# Altium project lemonCakes Project.PrjPcb
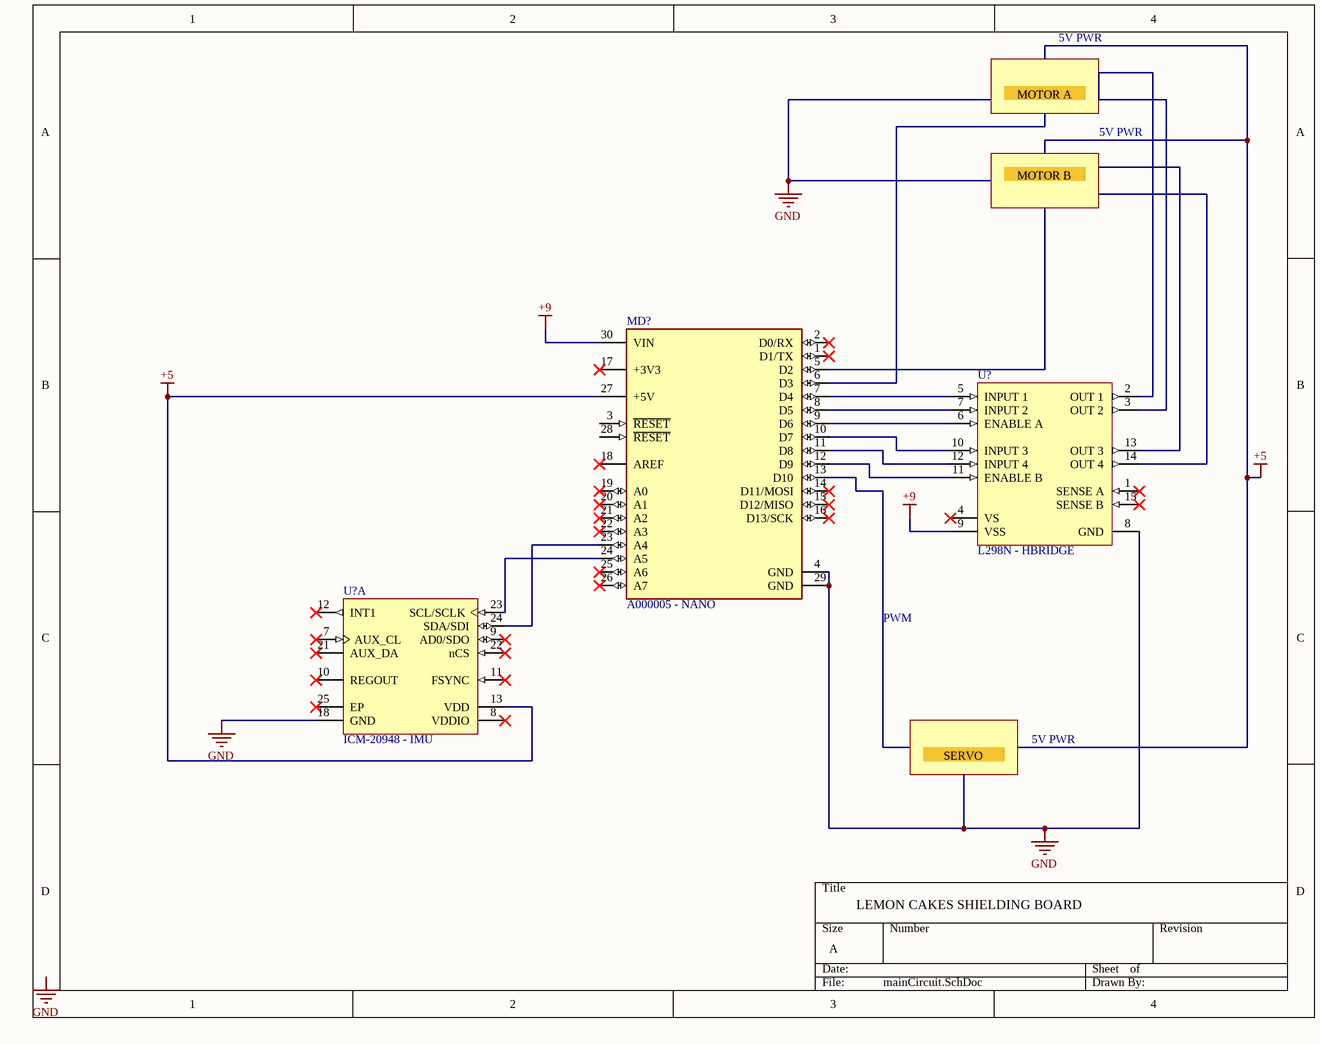
[diagram p0: mainCircuit.SchDoc]
1 sheet, 3 parts. Net scope: global (net labels, ports and power ports of the same name join across sheets).

## Sheet mainCircuit.SchDoc
size A; SheetNumber: 1; SheetTotal: 1

### Parts
(Parts that share a designator on the sheet are numbered #1, #2 ... from top to bottom, then left to right.)
MD?  A000005 - NANO  [FP-A000005-MFG]
U?#1  L298N - HBRIDGE  [STM-FM-15]
U?#2  ICM-20948 - IMU  [TDK-QFN-24_L]  (part A of 2)

### Nets
+5: MD?.27(+5V) U?#2.13(VDD)
+9: MD?.30(VIN) U?#1.9(VSS)
GND: MD?.4(GND) MD?.29(GND) U?#1.8(GND) U?#2.18(GND)
NetMD?_7: MD?.7(D4) U?#1.5(INPUT_1)
NetMD?_8: MD?.8(D5) U?#1.7(INPUT_2)
NetMD?_9: MD?.9(D6) U?#1.6(ENABLE_A)
NetMD?_10: MD?.10(D7) U?#1.10(INPUT_3)
NetMD?_11: MD?.11(D8) U?#1.12(INPUT_4)
NetMD?_12: MD?.12(D9) U?#1.11(ENABLE_B)
NetMD?_23: MD?.23(A4) U?#2.24(SDA/SDI)
NetMD?_24: MD?.24(A5) U?#2.23(SCL/SCLK)
NetU?#1_2: U?#1.2(OUT_1) U?#1.3(OUT_2)

Not connected (* = marked no-connect by the designer): MD? 1(D1/TX)* 2(D0/RX)* 3(~{RESET}) 5(D2) 6(D3) 13(D10) 14(D11/MOSI)* 15(D12/MISO)* 16(D13/SCK)* 17(+3V3)* 18(AREF)* 19(A0)* 20(A1)* 21(A2)* 22(A3)* 25(A6)* 26(A7)* 28(~{RESET}); U?#1 1(SENSE_A)* 4(VS)* 13(OUT_3) 14(OUT_4) 15(SENSE_B)*; U?#2 7(AUX_CL)* 8(VDDIO)* 9(AD0/SDO)* 10(REGOUT)* 11(FSYNC)* 12(INT1)* 21(AUX_DA)* 22(nCS)* 25(EP)*

### Notes on the sheet
- MOTOR A
- 5V PWR
- MOTOR B
- PWM
- SERVO
- LEMON CAKES SHIELDING BOARD
- Labels drawn without touching a wire or pin: GND

### Library data of the parts
MD? = CMP-189986-000002-1: ARDUINO NANO ATMEGA328 EVAL BRD; Number of Bits: 8; Evaluation Kit: Yes; Operating Supply Voltage: 12V; Interface: I2C; Data Bus Width: 8b; Core Architecture: AVR; Packaging: Bulk; Length: 7inch; Package Quantity: 50; Width: 5inch; REACH SVHC: No SVHC; Weight: 0.358383oz; Series: AVR® ATmega; Height: 0.25inch
U?#1 = CMP-2000-06526-1: Dual Full-Bridge Driver, 4.8 to 46 V, -40 to 150 degC, 15-Pin FM (MW 15L), RoHS, Tube; Manufacturer: STMicroelectronics; PartNumber: L298; Output Current: 2A; Supply Voltage Max: 7V; Driver Case Style: Multiwatt; Supply Voltage Min: 4.5V; No. of Pins: 15Pins; SVHC: NoSVHC(17-Dec-2015); Output Voltage: 46V; No. of Outputs: 4Outputs; Motor Type: FullBridge; MSL: -; Package Description: 15-Pin Flange Mount, Body 5 x 19.6 mm, Pitch 1.27 mm; Datasheet Version: 01/2000; Package Reference: FM-15; Mounting Technology: ThroughHole; Packaging: Each; Automotive Qualification Standard: -; Product Range: -; Datasheet URL: https://datasheet.ciiva.com/15109/getdatasheetpartid-50682-15109332.pdf; Operating Temperature Max: 130°C; Operating Temperature Min: -25°C; Manufacturer URL: http://www.st.com/
U?#2 = CMP-2000-07532-1: World’s Lowest Power 9-Axis MEMS MotionTracking(TM) Device, 1.71 to 3.6 V, -40 to 85 degC, 24-Pin QFN, RoHS, Tape and Reel; Manufacturer: TDK; Package Description: 24-Pin Quad Flat No-lead Package, Body 3 x 3 mm, Pitch 0.4 mm; Datasheet Version: Rev. 1.3, 06/2017; Package Reference: QFN-24; Mounting Technology: SurfaceMount; Datasheet URL: https://www.invensense.com/wp-content/uploads/2016/06/DS-000189-ICM-20948-v1.3.pdf; Manufacturer URL: http://www.tdk.com/